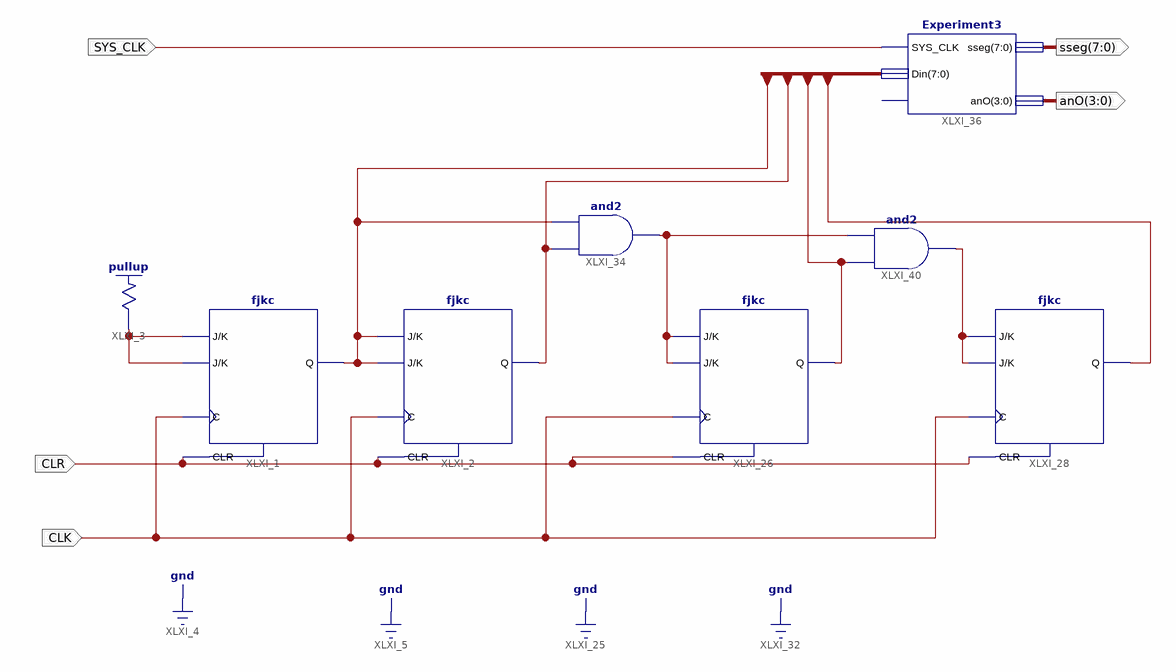
[diagram p0: schematic sheet 1]
// Xilinx ISE schematic EXperiment5.sch (spartan3e) as structural Verilog: 8 symbols, 5 ports
module EXperiment5 (
  input  CLR,
  input  CLK,
  input  SYS_CLK,
  output [7:0] sseg,
  output [3:0] anO
);

  wire XLXN_3, XLXN_53, XLXN_86;
  wire [7:0] Din;

  fjkc XLXI_1 (.C(CLK), .CLR(CLR), .J(XLXN_3), .K(XLXN_3), .Q(Din[0]));
  \pullup  XLXI_3 (.O(XLXN_3));
  fjkc XLXI_2 (.C(CLK), .CLR(CLR), .J(Din[0]), .K(Din[0]), .Q(Din[1]));
  Experiment3 XLXI_36 (.SYS_CLK(SYS_CLK), .Din(Din), .sseg(sseg), .anO(anO));  // open: En
  fjkc XLXI_28 (.C(CLK), .CLR(CLR), .J(XLXN_53), .K(XLXN_53), .Q(Din[3]));
  fjkc XLXI_26 (.C(CLK), .CLR(CLR), .J(XLXN_86), .K(XLXN_86), .Q(Din[2]));
  and XLXI_34 (XLXN_86, Din[1], Din[0]);
  and XLXI_40 (XLXN_53, Din[2], XLXN_86);
endmodule
